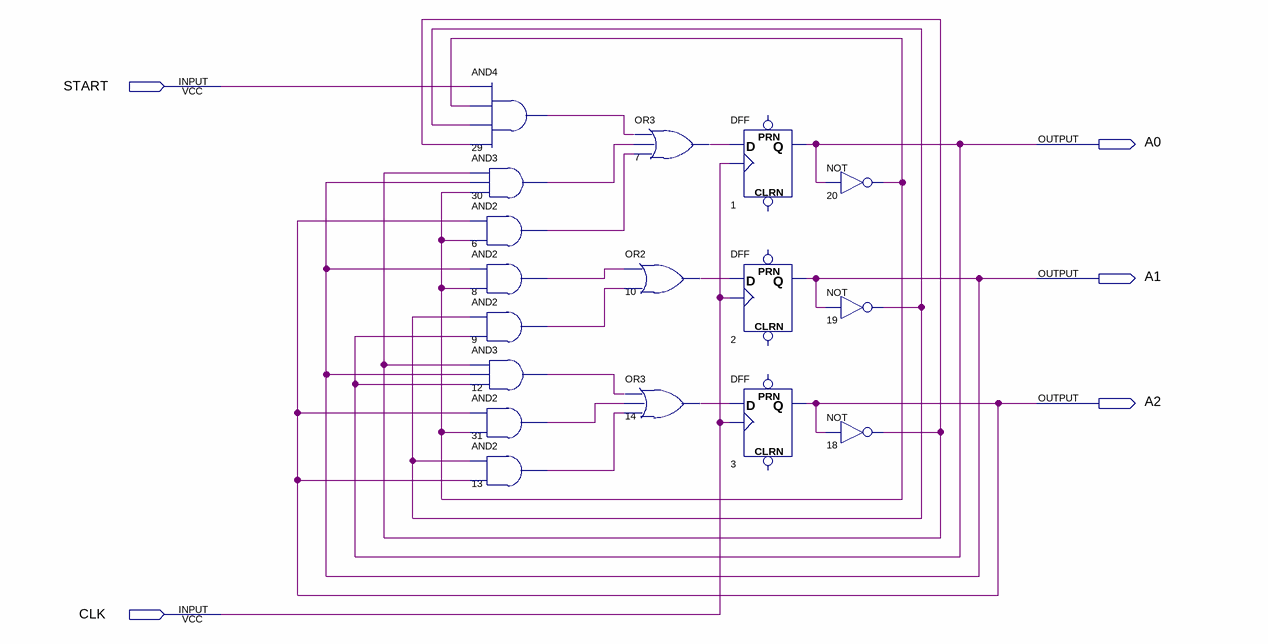
[diagram p0: schematic sheet]
// Quartus schematic counter.bdf as structural Verilog: 17 symbols, 5 pins
module counter (
  input  START,
  input  CLK,
  output A0,
  output A1,
  output A2
);

  wire n6_out, n7_out, n8_out, n9_out, n10_out, n12_out, n13_out, n14_out, n18_out, n19_out, n20_out,
       n29_out, n30_out, n31_out;

  and u_29 (n29_out, START, n20_out, n19_out, n18_out);
  and u_30 (n30_out, n18_out, A1, n20_out);
  and u_6 (n6_out, A2, n20_out);
  and u_8 (n8_out, A1, n20_out);
  and u_9 (n9_out, n19_out, A0);
  and u_12 (n12_out, n18_out, A1, A0);
  and u_31 (n31_out, A2, n20_out);
  and u_13 (n13_out, n19_out, A2);
  or u_7 (n7_out, n29_out, n30_out, n6_out);
  or u_10 (n10_out, n8_out, n9_out);
  or u_14 (n14_out, n12_out, n31_out, n13_out);
  DFF u_1 (.CLK(CLK), .D(n7_out), .Q(A0));  // open: CLRN, PRN
  DFF u_2 (.CLK(CLK), .D(n10_out), .Q(A1));  // open: CLRN, PRN
  DFF u_3 (.CLK(CLK), .D(n14_out), .Q(A2));  // open: CLRN, PRN
  not u_20 (n20_out, A0);
  not u_19 (n19_out, A1);
  not u_18 (n18_out, A2);
endmodule
